# Altium schematic sheet 00_TopLevel.SchDoc
size A4; SheetNumber: 1; SheetTotal: 4
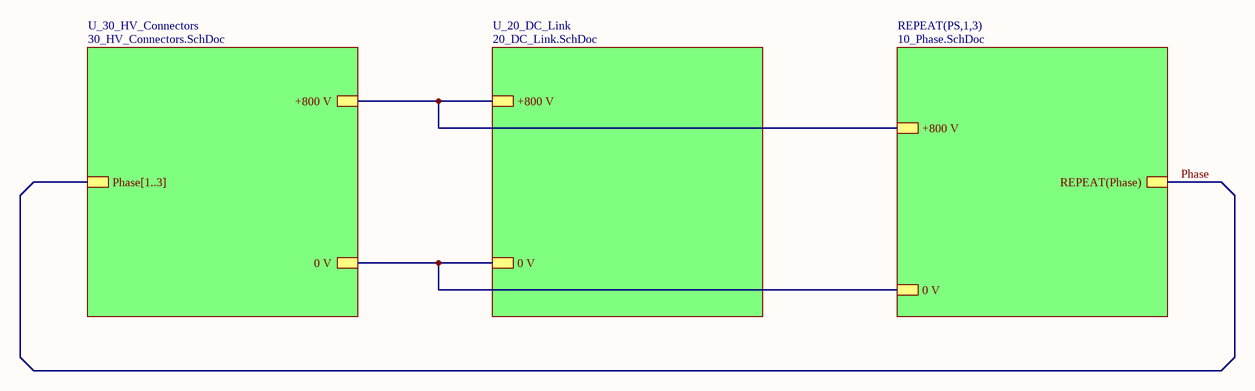
[diagram p0: 00_TopLevel.SchDoc]

## Sub-sheets
REPEAT(PS,1,3) = 10_Phase.SchDoc: REPEAT(Phase), +800 V, 0 V
U_20_DC_Link = 20_DC_Link.SchDoc: +800 V, 0 V
U_30_HV_Connectors = 30_HV_Connectors.SchDoc: 0 V, +800 V, Phase[1..3]

## Nets
Phase: sheet REPEAT(PS,1,3)/REPEAT(Phase)
(unnamed): sheet REPEAT(PS,1,3)/+800 V, sheet U_20_DC_Link/+800 V, sheet U_30_HV_Connectors/+800 V
(unnamed): sheet REPEAT(PS,1,3)/0 V, sheet U_20_DC_Link/0 V, sheet U_30_HV_Connectors/0 V